# Altium project Desk lamp.PrjPcb
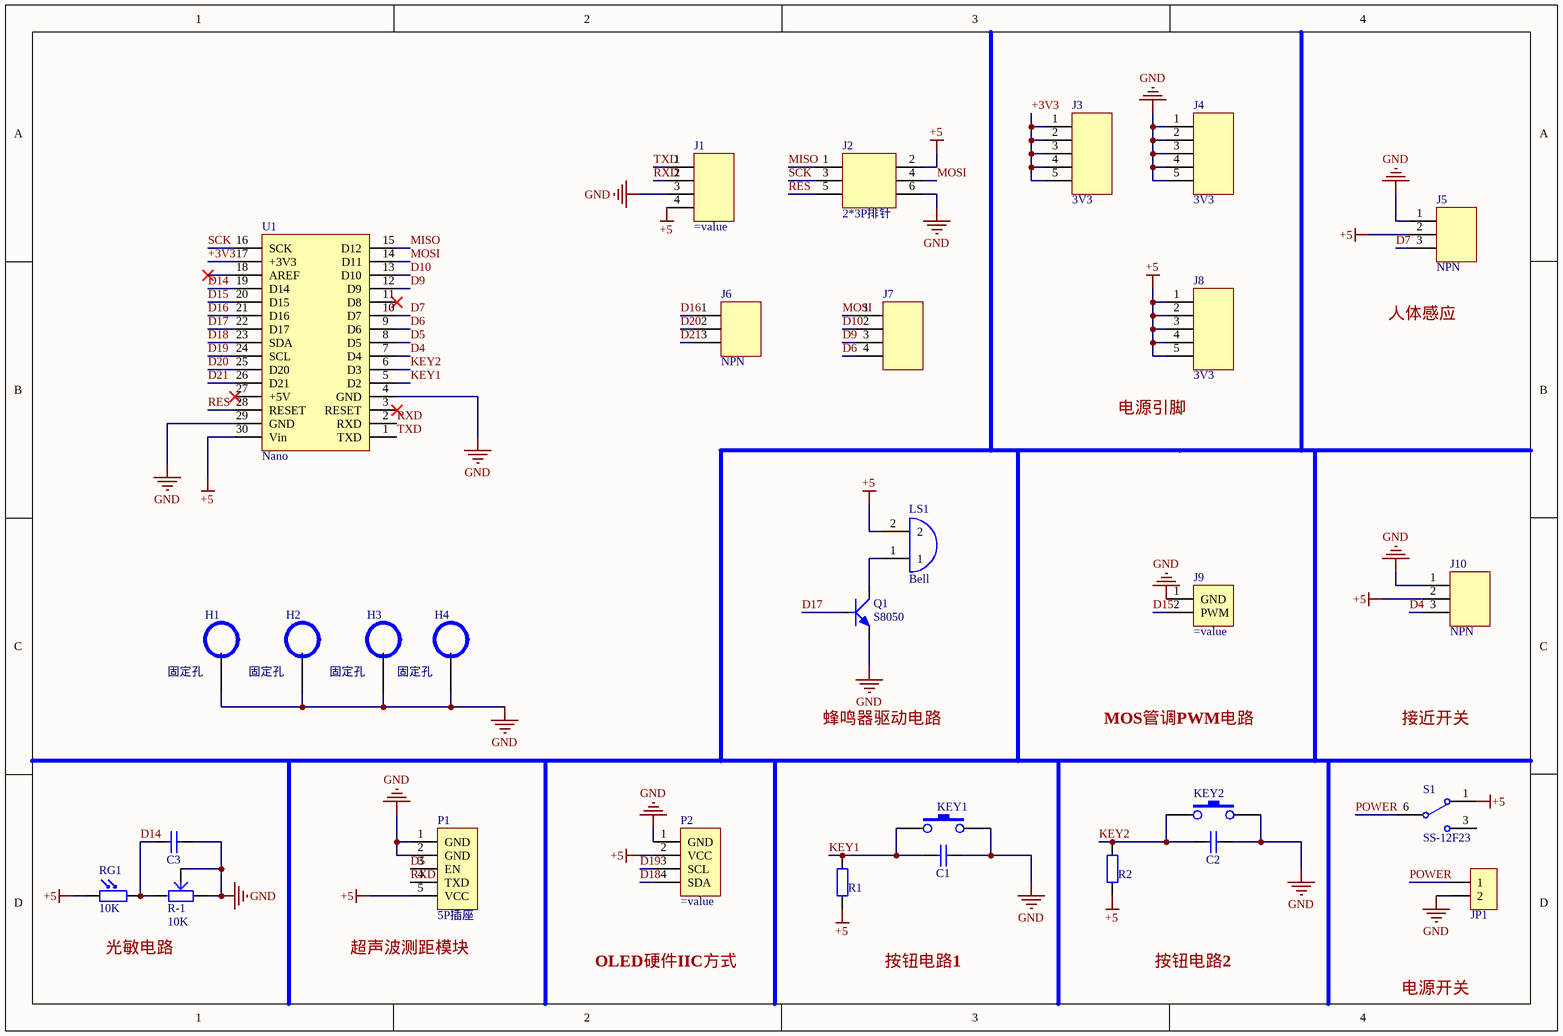
[diagram p0: Desk lamp原理图.SchDoc]
1 sheet, 30 parts. Net scope: global (net labels, ports and power ports of the same name join across sheets).
Board file: Desk lamp PCB.PcbDoc

## Sheet Desk lamp原理图.SchDoc
size A4

### Parts
C1  (no value)  [C 0805_L]
C2  (no value)  [C 0805_L]
C3  (no value)  [C 0805_L]
H1  固定孔  [M3x6+6_L]
H2  固定孔  [M3x6+6_L]
H3  固定孔  [M3x6+6_L]
H4  固定孔  [M3x6+6_L]
J1  (no value)  [XH2.54-LI-4P]
J2  2*3P排针  [HDR2.54-LI-2x3P]
J3  3V3  [HDR2.54-LI-5P]
J4  3V3  [HDR2.54-LI-5P]
J5  NPN  [HDR2.54-LI-3P]
J6  NPN  [HDR2.54-LI-3P]
J7  (no value)  [XH2.54-LI-4P]
J8  3V3  [HDR2.54-LI-5P]
J9  (no value)  [XH2.54-LI-2P]
J10  NPN  [HDR2.54-LI-3P]
JP1  HDR-1X2  [HT3.96-WI-2P-ORG]  (value not drawn)
KEY1  KEY  [_key_]  (value not drawn)
KEY2  KEY  [_key_]  (value not drawn)
LS1  Bell  [BEEP 7.6x12x9.5]
P1  5P插座  [XH2.54-LI-5P]
P2  (no value)  [XH2.54-LI-4P]
Q1  S8050  [SOT23-3L]
R1  10K  [R 0603]  (value not drawn)
R2  10K  [R 0603]  (value not drawn)
R-1  10K  [3319P]
RG1  10K  [RG5528]
S1  SS-12F23  [KFC DIP-8X8]
U1  Nano  [Nano]

### Nets
+5: J1.4(SDA) J2.2(GND) J5.2(VCC) J8.1(GND) J8.2(GND) J8.3(GND) J8.4(GND) J8.5(GND) J10.2(VCC) LS1.2 P1.5(VCC) P2.2(VCC) R1.1 R2.1 RG1.1 S1.1 U1.30(Vin)
GND: C1.2 C2.2 C3.2 H1.1 H2.1 H3.1 H4.1 J1.3(SCL) J2.6(GND) J4.1(GND) J4.2(GND) J4.3(GND) J4.4(GND) J4.5(GND) J5.1(GND) J9.1(GND) J10.1(GND) JP1.2 KEY1.2 KEY2.2 P1.1(GND) P1.2(GND) P2.1(GND) Q1.1 R-1.2 R-1.3 U1.4(GND) U1.29(GND)
+3V3: J3.1(GND) J3.2(GND) J3.3(GND) J3.4(GND) J3.5(GND) U1.17(+3V3)
D4: J10.3(DC) U1.7(D4)
D5: P1.3(EN) U1.8(D5)
D6: J7.4(SDA) U1.9(D6)
D7: J5.3(DC) U1.10(D7)
D9: J7.3(SCL) U1.12(D9)
D10: J7.2(VCC) U1.13(D10)
D14: C3.1 R-1.1 RG1.2 U1.19(D14)
D15: J9.2(PWM) U1.20(D15)
D16: J6.1(GND) U1.21(D16)
D17: Q1.3 U1.22(D17)
D18: P2.4(SDA) U1.23(SDA)
D19: P2.3(SCL) U1.24(SCL)
D20: J6.2(VCC) U1.25(D20)
D21: J6.3(DC) U1.26(D21)
KEY1: C1.1 KEY1.1 R1.2 U1.5(D2)
KEY2: C2.1 KEY2.1 R2.2 U1.6(D3)
MISO: J2.1(GND) U1.15(D12)
MOSI: J2.4(GND) J7.1(GND) U1.14(D11)
POWER: JP1.1 S1.6
RES: J2.5(DC) U1.28(RESET)
RXD: J1.2(VCC) P1.4(TXD) U1.2(RXD)
SCK: J2.3(VCC) U1.16(SCK)
TXD: J1.1(GND) U1.1(TXD)
NetLS1_1: LS1.1 Q1.2

Not connected (* = marked no-connect by the designer): S1 3; U1 3(RESET)* 11(D8)* 18(AREF)* 27(+5V)*

### Notes on the sheet
- 人体感应
- (near J8) 电源引脚
- 蜂鸣器驱动电路
- MOS管调PWM电路
- 接近开关
- 光敏电路
- (near P1) 超声波测距模块
- OLED硬件IIC方式
- Text
- 按钮电路1
- 按钮电路2
- 电源开关
- Title
- Size:
- Date:
- A4
- Number:
- Time:
- Revision:
- Sheet
- of
- File:

### Library data of the parts
C1-C3 = Cap: 无极性电容
J1 J7 = 4P插座: 2.54插座
J2 = 2*3P排针: 双排针
J3 J4 J8 = 5P排针: 2.54排针
J5 J6 J10 = 3P插座: 2.54插座
J9 = MOS管: 2.54插座
JP1 = Header 2: 2P接插件; BOM名称: 2P接插件
KEY1 KEY2 = KEY: 按钮
LS1 = Bell: Electrical Bell; Published: 24-Mar-1999; LatestRevisionDate: 17-Jul-2002; LatestRevisionNote: Re-released for DXP Platform.; PackageReference: PIN2; Publisher: Altium Limited
P1 = 5P插座: 2.54插座
P2 = OLED: 显示屏
R1 R2 = Res: 电阻; value: 10K
R-1 = 电位器
RG1 = RG5528: 光敏电阻; BOM名称: 光敏电阻
S1 = SSW-1P: 1路波动开关; BOM名称: 波动开关
U1 = Nano: Arduino